# Altium schematic sheet Peripherals.SchDoc: Motor Controller - Peripherals
size A3; Author: Poteko Sakamoto; DrawnBy: Poteko Sakamoto; Revision: 2
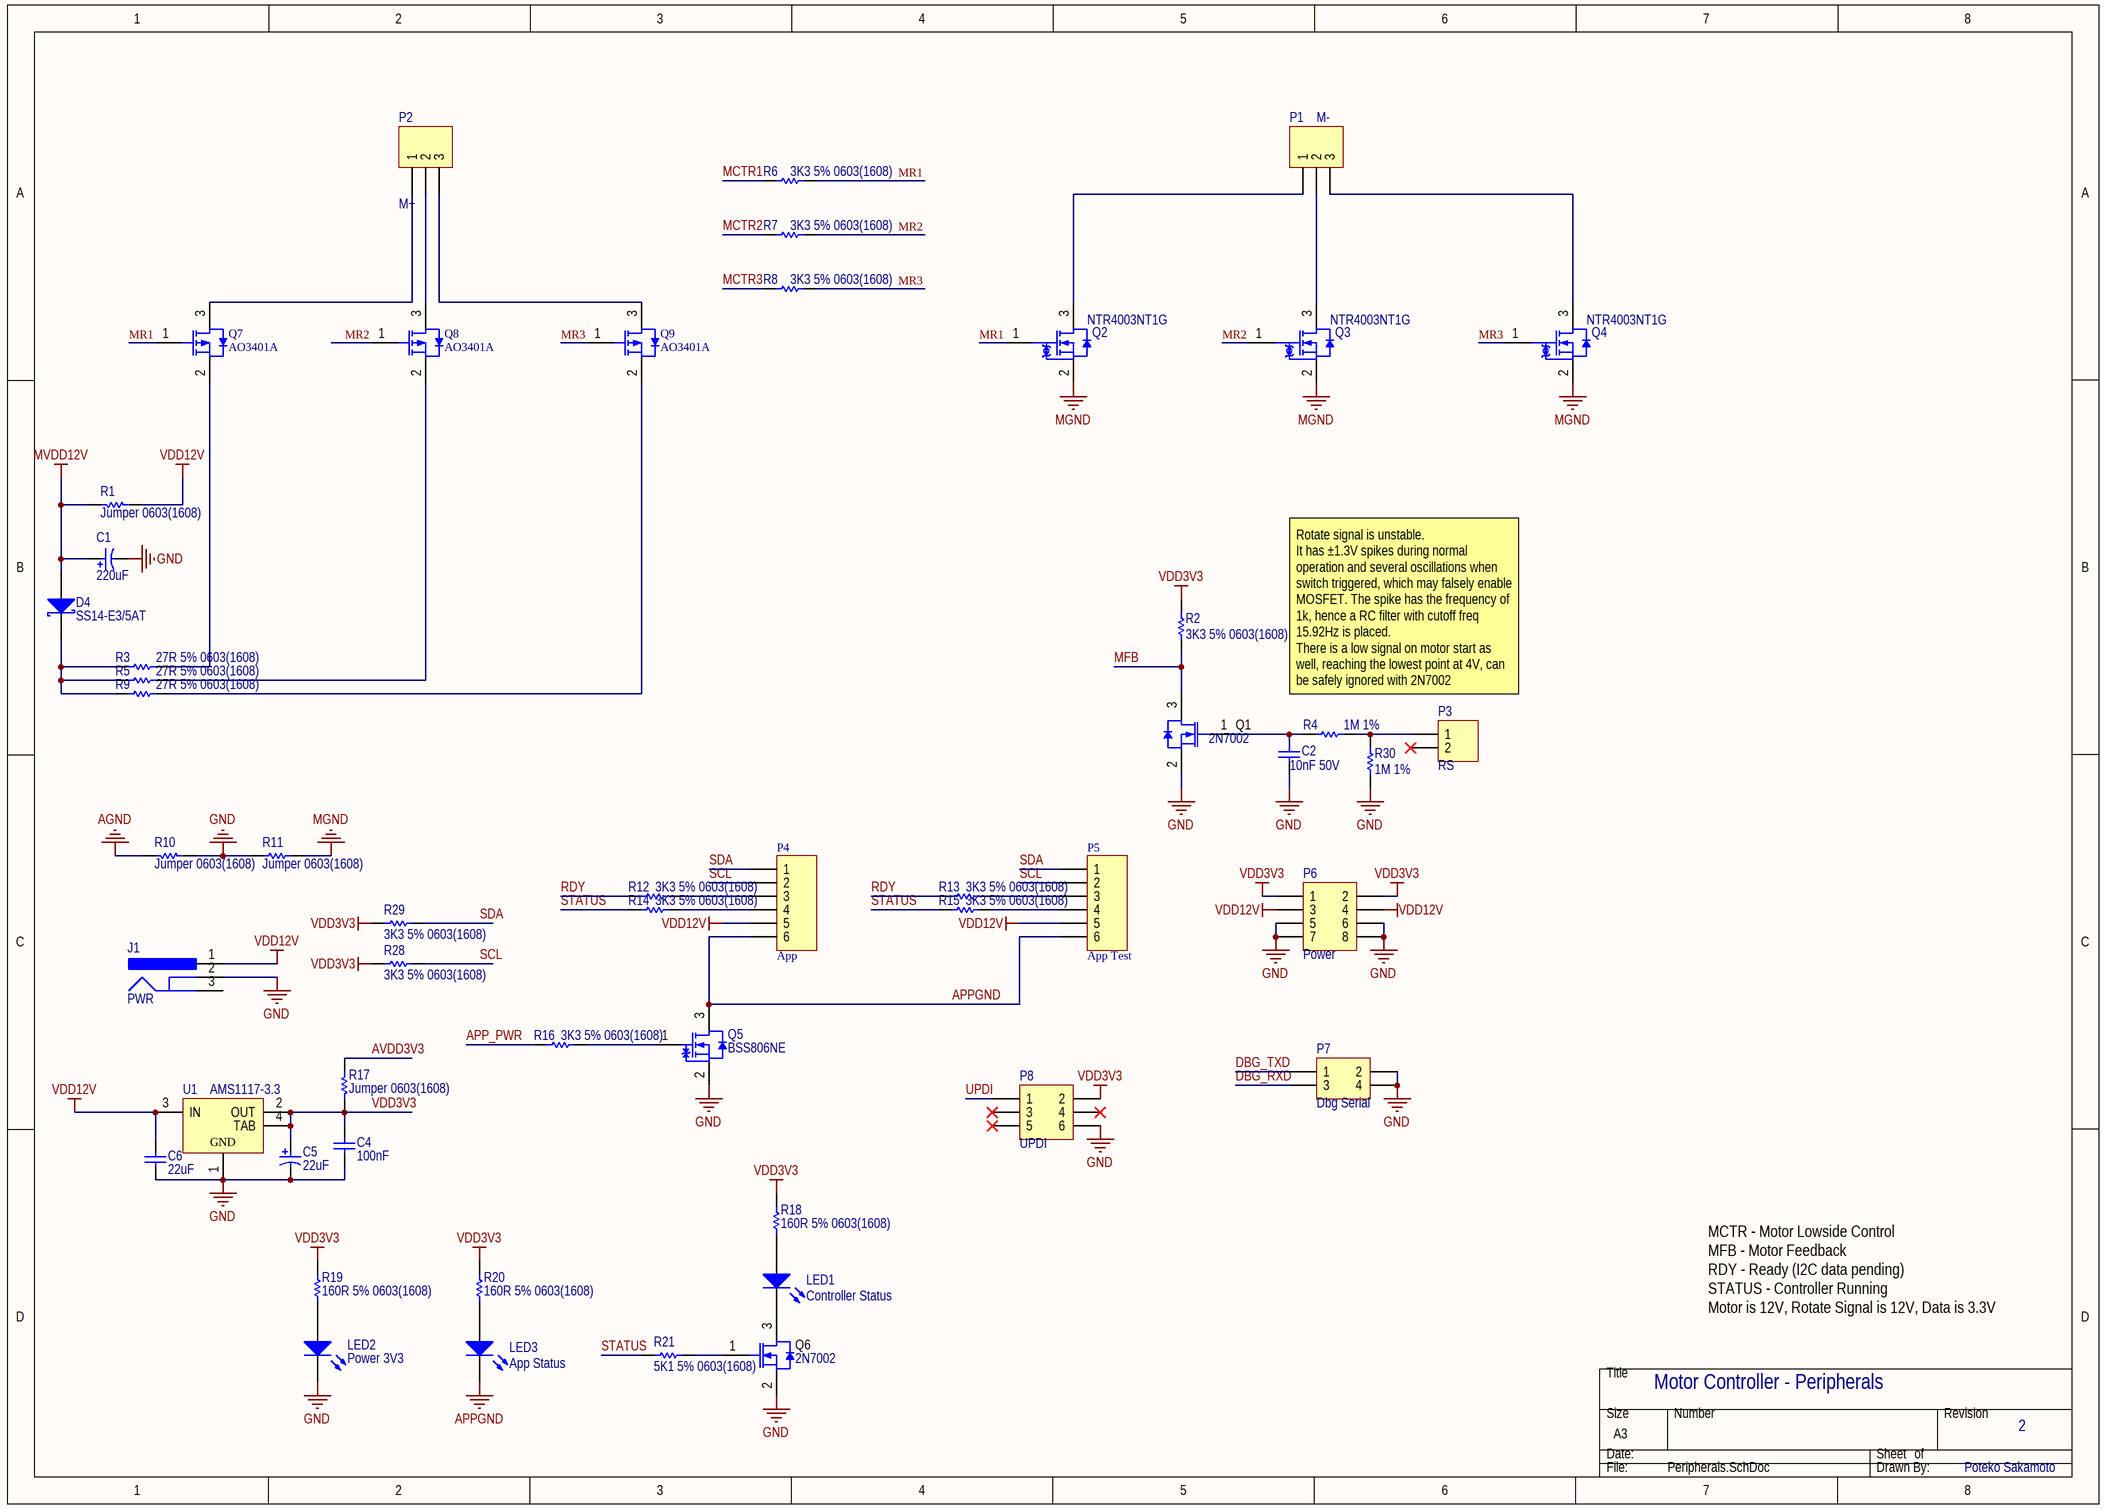
[diagram p0: Peripherals.SchDoc]

## Parts
C1  220uF  [PNSC-ZA-G_M]
C2  10nF 50V  [CAPC0603(1608)100_M]
C4  100nF  [CAPC0603(1608)100_M]
C5  22uF  [KEMT-A-3216-18-2_M]
C6  22uF  [CAPC0805(2012)145_M]
D4  SS14-E3/5AT  [VISH-DO-214AC-2_V]
J1  PWR  [KYCN-KLDX-0202-A_V]
LED1  Controller Status  [0805_A]
LED2  Power 3V3  [0805_A]
LED3  App Status  [0805_A]
P1  M-  [HDR1X3]
P2  M+  [HDR1X3]
P3  RS  [HDR1X2]
P4  App  [PH2.0-WS-6P]
P5  App Test  [HDR1X6]
P6  Power  [HDR2X4]
P7  Dbg Serial  [HDR2X2]
P8  UPDI  [HDR2X3]
Q1  2N7002  [INF-PG-SOT23_M]
Q2  NTR4003NT1G  [ONSC-SOT-23-3-318-08_V]
Q3  NTR4003NT1G  [ONSC-SOT-23-3-318-08_V]
Q4  NTR4003NT1G  [ONSC-SOT-23-3-318-08_V]
Q5  BSS806NE  [INF-PG-SOT23-3_N]
Q6  2N7002  [INF-PG-SOT23_M]
Q7  AO3401A  [AO-SOT-23-3L_V]
Q8  AO3401A  [AO-SOT-23-3L_V]
Q9  AO3401A  [AO-SOT-23-3L_V]
R1  Jumper 0603(1608)  [RESC0603(1608)_M]
R2  3K3 5% 0603(1608)  [RESC0603(1608)_M]
R3  27R 5% 0603(1608)  [RESC0603(1608)_M]
R4  1M 1%  [RESC0603(1608)_M]
R5  27R 5% 0603(1608)  [RESC0603(1608)_M]
R6  3K3 5% 0603(1608)  [RESC0603(1608)_M]
R7  3K3 5% 0603(1608)  [RESC0603(1608)_M]
R8  3K3 5% 0603(1608)  [RESC0603(1608)_M]
R9  27R 5% 0603(1608)  [RESC0603(1608)_M]
R10  Jumper 0603(1608)  [RESC0603(1608)_M]
R11  Jumper 0603(1608)  [RESC0603(1608)_M]
R12  3K3 5% 0603(1608)  [RESC0603(1608)_M]
R13  3K3 5% 0603(1608)  [RESC0603(1608)_M]
R14  3K3 5% 0603(1608)  [RESC0603(1608)_M]
R15  3K3 5% 0603(1608)  [RESC0603(1608)_M]
R16  3K3 5% 0603(1608)  [RESC0603(1608)_M]
R17  Jumper 0603(1608)  [RESC0603(1608)_M]
R18  160R 5% 0603(1608)  [RESC0603(1608)_M]
R19  160R 5% 0603(1608)  [RESC0603(1608)_M]
R20  160R 5% 0603(1608)  [RESC0603(1608)_M]
R21  5K1 5% 0603(1608)  [RESC0603(1608)_M]
R28  3K3 5% 0603(1608)  [RESC0603(1608)_M]
R29  3K3 5% 0603(1608)  [RESC0603(1608)_M]
R30  1M 1%  [RESC0603(1608)_M]
U1  AMS1117-3.3  [DCY0004A_M]

## Nets
AGND: R10.2
APPGND: LED3.1(K) P4.6 P5.6 Q5.3(DRAIN)
GND: C1.2 C2.1 C4.1 C5.2 C6.1 J1.2 LED2.1(K) P6.5 P6.6 P6.7 P6.8 P7.2 P7.4 P8.6 Q1.2(SOURCE) Q5.2(SOURCE) Q6.2(SOURCE) R10.1 R11.1 R30.1 U1.1(GND)
MGND: Q2.2(S) Q3.2(S) Q4.2(S) R11.2
MVDD12V: C1.1 D4.1(A) R1.2
VDD3V3: C4.2 C5.1 P6.1 P6.2 P8.2 R2.1 R17.2 R18.2 R19.2 R20.2 R28.1 R29.1 U1.2(OUT) U1.4(TAB)
VDD12V: C6.2 J1.1 P4.5 P5.5 P6.3 P6.4 R1.1 U1.3(IN)
APP_PWR: R16.2
AVDD3V3: R17.1
DBG_RXD: P7.3
DBG_TXD: P7.1
MCTR1: R6.2
MCTR2: R7.2
MCTR3: R8.2
MFB: Q1.3(DRAIN) R2.2
MR1: Q2.1(G) Q7.1(GATE) R6.1
MR2: Q3.1(G) Q8.1(GATE) R7.1
MR3: Q4.1(G) Q9.1(GATE) R8.1
RDY: R12.2 R13.2
SCL: P4.2 P5.2 R28.2
SDA: P4.1 P5.1 R29.2
STATUS: R14.2 R15.2 R21.1
UPDI: P8.1
NetC2_2: C2.2 Q1.1(GATE) R4.1
NetD4_2: D4.2(K) R3.1 R5.1 R9.1
NetLED1_1: LED1.1(K) Q6.3(DRAIN)
NetLED1_2: LED1.2(A) R18.1
NetLED2_2: LED2.2(A) R19.1
NetLED3_2: LED3.2(A) R20.1
NetP1_1: P1.1 Q2.3(D)
NetP1_2: P1.2 Q3.3(D)
NetP1_3: P1.3 Q4.3(D)
NetP2_1: P2.1 Q7.3(DRAIN)
NetP2_2: P2.2 Q8.3(DRAIN)
NetP2_3: P2.3 Q9.3(DRAIN)
NetP3_1: P3.1 R4.2 R30.2
NetP4_3: P4.3 R12.1
NetP4_4: P4.4 R14.1
NetP5_3: P5.3 R13.1
NetP5_4: P5.4 R15.1
NetQ5_1: Q5.1(GATE) R16.1
NetQ6_1: Q6.1(GATE) R21.2
NetQ7_2: Q7.2(SOURCE) R3.2
NetQ8_2: Q8.2(SOURCE) R5.2
NetQ9_2: Q9.2(SOURCE) R9.2

Not connected (* = marked no-connect by the designer): J1 3; P3 2*; P8 3* 4* 5*

## Notes on the sheet
- Rotate signal is unstable.
  It has ±1.3V spikes during normal operation and several oscillations when switch triggered, which may falsely enable MOSFET. The spike has the frequency of 1k, hence a RC filter with cutoff freq 15.92Hz is placed.
  There is a low signal on motor start as well, reaching the lowest point at 4V, can be safely ignored with 2N7002
- MCTR - Motor Lowside Control
  MFB - Motor Feedback
  RDY - Ready (I2C data pending)
  STATUS - Controller Running
  Motor is 12V, Rotate Signal is 12V, Data is 3.3V
- Title
- Size:
- Date:
- A4
- Number:
- Time:
- Revision:
- Sheet
- of
- File:

## Library data of the parts
C1 = CMP-2000-06221-1: Conductive Polymer Hybrid Aluminum Electrolytic Capacitor, 220 uF, +/- 20%, 50 V, -55 to 105 degC, 2-Pin SMD (G), RoHS, Tape and Reel; Case Height: 10.5mm; Voltage Rating DC: 50V; Case Diameter: 10mm; Ripple Current: 2A; Load Life: 10000Hour; Brand: Panasonic; Case Length: 10.2mm; ESR: 28mOhms; Capacitance: 100uF; Manufacturer URL: http://www.panasonic.com/; Minimum Operating Temperature: -55C; Datasheet Version: 06/2016; Product Category: AluminumOrganicPolymerCapacitors; Maximum Operating Temperature: +105C; Package Description: 2-Pin Surface Mount Device, Body 10.3 x 10.3 mm; Package Reference: ZA-G; RoHS: Details; Series: ZA; Tolerance: 20%; Product: AluminumElectrolyticCapacitors; Factory Pack Quantity: 500; Manufacturer: Panasonic; Termination Style: SMD/SMT; Datasheet URL: https://industrial.panasonic.com/cdbs/www-data/pdf/RDD0000/DMD0000COL56.pdf; Mounting Technology: SurfaceMount; Packaging: Reel; Height: 10.5mm
C2 = CMP-1035-02320-1: CAP 10nF 50V ±5% 0603 (1608 Metric) Thickness 1mm SMD; Case-EIA: 0603; Tolerance: Â±5%; Case-Metric: 1608; Value: 10nF; Max Thickness: 1 mm; Technology: SMT; Rated Voltage: 50 V
C4 = CMP-1035-02592-1: CAP 100nF 50V ±10% 0603 (1608 Metric) Thickness 1mm SMD; Case-EIA: 0603; Case-Metric: 1608; Tolerance: Â±10%; Technology: SMT; Rated Voltage: 50 V; Max Thickness: 1 mm; Value: 100nF
C5 = CMP-2000-05173-1: Capacitor, Tantalum, 22 uF, +/- 10%, 16 V, -55 to 125 degC, 2-Pin SMD (1206), RoHS, Tape and Reel; Manufacturer: Kemet; Insulation: NotRequired; Voltage: 16VDC; Capacitance: 10uF; Product Height (mm): 1.6mm; Polarity: Polar; Lead Spacing (nom): NotRequiredmm; Product Length (mm): 3.2mm; Case Style: Molded; DCL: 1.6uA; ESR: 7ohm; DF: 8%; Mounting Style: SurfaceMount; Manufacturer URL: http://www.kemet.com/; Datasheet Version: Apr-14; Package Description: 2-Pin Surface Mount Device, Body 3.2 x 1.6 mm; Operating Temp Range: -55Cto125C; Package Reference: 1206; Wire Form: NotRequired; Datasheet URL: http://www.farnell.com/datasheets/1824869.pdf; Tolerance (+ or -): 10%; Failure Rate: NotRequired; Length W/Weld: NotRequiredmm; Package / Case: 3216-18; Seated Plane Height: NotRequiredmm; Product Diameter (mm): NotRequiredmm; Construction: SMTChip; Seal: NotRequired; Case Code: A; Product Depth (mm): 1.6mm; Packaging: TapeandReel
C6 = CMP-1036-04942-1: CAP 22uF 10V ±10% 0805 (2012 Metric) Thickness 1.45mm SMD; Case-EIA: 0805; Case-Metric: 2012; Tolerance: Â±10%; Rated Voltage: 10 V; Max Thickness: 1.45 mm; Value: 22uF; Technology: SMT
D4 = CMP-0549-00004-1: Schottky Barrier Rectifier, 40 V Maximum DC Blocking Voltage, -65 to 125 degC, 2-Pin SMA Case, RoHS; Manufacturer: Vishay Semiconductor; IFSM: 40 A; IF(AV): 1 A Max.; VRRM: 40 V Max.; VRMS: 28 V Max.; PackageReference: DO-214AC-2; RoHS: TRUE; DatasheetVersion: 12/17/2012; ComponentLink1Description: Manufacturer URL; ComponentLink2URL: http://www.vishay.com/docs/88746/ss12.pdf; PartNumber: SS14-E3/5AT; PackageVersion: Dec-12; Operating Temperature: -65 to 125 degC; ComponentLink3URL: http://www.vishay.com/docs/88746/ss12.pdf; PackageDescription: 2-Pin SMD, Body 4.245 x 2.665 mm, Height 2.29 mm; ComponentLink1URL: http://www.vishay.com/; ComponentLink3Description: Package Specification; ComponentLink2Description: Datasheet; Mounting Technology: Surface Mount; VDC: 40 V Max.
J1 = CMP-1673-00001-5: DC Power Jack, 24 V, 3.5 A, -25 to 85 degC, 3-Pin THD, RoHS; Manufacturer: Kycon; Voltage Rating: 24 V; Current Rating: 3.5 A; PackageReference: KLDX-0202-A; ComponentLink1URL: http://www.kycon.com/; ComponentLink1Description: Manufacturer URL; Height: 10.8 mm; Length: 9.2 mm; Pins: 2; Housing Material: PBT; Connector Type: Power; ComponentLink2URL: http://www.kycon.com/Pub_Eng_Draw/KLDX-0202-X.PDF; PackageDescription: 3-Pin Through Hole Device, Body 14.5 x 9 mm; Max Operating Temperature: 85 degC; Min Operating Temperature: -25 degC; Contact Gender: Female; Package Quantity: 500; Mount: Through Hole; Colour: Black; Contact Plating: Tin; DatasheetVersion: Rev. D3, 06/2013; ComponentLink2Description: Datasheet; RoHSCompliant: true; Mounting Technology: Through Hole; Contact Material: Brass
LED1 LED3 = CMP-1426-00008-1: SMD mono-color Chip LED, WL-SMCW, Blue; Manufacturer: Wuerth Elektronik; PartNumber: 150080BS75000; Color: Blue; ComponentLink2URL: http://katalog.we-online.com/led/datasheet/150080BS75000.pdf; ComponentLink1URL: http://www.we-online.com; ComponentLink2Description: Datasheet; PackageReference: 0805_A; ComponentLink1Description: Manufacturer URL
LED2 = CMP-1426-00007-1: SMD mono-color Chip LED, WL-SMCW, Green; PartNumber: 150080GS75000; Manufacturer: Wuerth Elektronik; PackageReference: 0805_A; Color: Green; ComponentLink2URL: http://katalog.we-online.com/led/datasheet/150080GS75000.pdf; ComponentLink1URL: http://www.we-online.com; ComponentLink1Description: Manufacturer URL; ComponentLink2Description: Datasheet
P1 P2 = Header 3: Header, 3-Pin; LatestRevisionDate: 17-Jul-2002; LatestRevisionNote: Re-released for DXP Platform.; Publisher: Altium Limited
P3 = Header 2: Header, 2-Pin; LatestRevisionDate: 17-Jul-2002; LatestRevisionNote: Re-released for DXP Platform.; Publisher: Altium Limited
P4 P5 = Header 6: Header, 6-Pin; LatestRevisionDate: 17-Jul-2002; LatestRevisionNote: Re-released for DXP Platform.; Publisher: Altium Limited
P6 = Header 4X2: Header, 4-Pin, Dual row; LatestRevisionDate: 17-Jul-2002; LatestRevisionNote: Re-released for DXP Platform.; Publisher: Altium Limited
P7 = Header 2X2: Header, 2-Pin, Dual row; LatestRevisionDate: 17-Jul-2002; LatestRevisionNote: Re-released for DXP Platform.; Publisher: Altium Limited
P8 = Header 3X2: Header, 3-Pin, Dual row; LatestRevisionDate: 17-Jul-2002; LatestRevisionNote: Re-released for DXP Platform.; Publisher: Altium Limited
Q1 Q6 = CMP-1149-00026-1: N-Channel OptiMOS Small-Signal-Transistor, 60 V VDS, 0.3 A ID, -55 to 150 degC, PG-SOT23, Reel, Green; Manufacturer: Infineon; RDS (on) (max) (@4.5V): 4,000 mOhm; VDS (max): 60 V; IDpuls (max): 1.2Â A; QG: 0.4Â nC; RDS (on) (max): 3,000 mOhm; RthJA (max): 250 K/W; ID (max): 0.3Â A; VGS(th) (max): 2.5Â V; VGS(th) (min): 1.5Â V; Green: TRUE; Ptot (max): 0.5Â W; PackageDescription: 3-Pin Small Outline Transistor Package, 2.9 x 1.3 mm Body, 0.95 mm Pitch; Halogen-free: TRUE; ComponentLink2Description: Datasheet; ComponentLink1URL: http://www.infineon.com/; Packing: Reel; DatasheetVersion: Rev. 2.4; PartNumber: 2N7002; PackageReference: PG-SOT23; PackageVersion: Apr-08; ComponentLink3URL: http://www.infineon.com/dgdl/SOT23-Package_Overview.pdf?folderId=db3a30431936bc4b0119532290053c66&fileId=db3a30431936bc4b0119533468123c85; ComponentLink1Description: Manufacturer URL; Mounting Technology: Surface Mount; ComponentLink3Description: Package Specification; ComponentLink2URL: http://www.infineon.com/dgdl/2N7002_Rev2.4.pdf?folderId=db3a3043156fd573011622e10b5c1f67&fileId=db3a304319bc939a0119c2a9461e79e6
Q2-Q4 = CMP-1058-00759-1: Small Signal MOSFET, 30 V, 0.56 A, Single N-Channe, 3-Pin SOT-23, Pb-Free, Tape and Reel; Manufacturer: On Semiconductor; ID Max (A): 0.56; VGS(th) Max (V): 1.4; Coss Typ (pF): 19.7; Channel Polarity: N Channel; Ciss Typ (pF): 21; Crss Typ (pF): 8.1; V(BR)DSS Min (V): 30; VGS Max (V): 20; ComponentLink2Description: Datasheet; Configuration: Single; ComponentLink3Description: Package Specification; PackageDescription: 3-Pin Small Outline Transistor, Body 2.92 x 1.3 mm, Pitch 0.95 mm; DatasheetVersion: Rev. 3; ComponentLink1URL: http://www.onsemi.com/; Mounting Technology: Surface Mount; Package Type: SOT-23-3; RoHS: Pb-Free; PackageVersion: Rev. AP, 11/2009; PartNumber: NTR4003NT1G; ComponentLink3URL: http://www.onsemi.cn/pub_link/Collateral/318-08.PDF; Packing: Tape and Reel; ComponentLink2URL: http://www.onsemi.cn/pub_link/Collateral/NTR4003N-D.PDF; ComponentLink1Description: Manufacturer URL; PackageReference: SOT-23-3-318-08
Q5 = CMP-1149-00037-1: N-Channel OptiMOS(TM)2 Small-Signal-Transistor, 20 V VDS, 2.3 A ID, -55 to 150 degC, PG-SOT23-3, Reel, Green; Manufacturer: Infineon; Green: TRUE; ID (max): 2.3Â A; IDpuls (max): 9.3Â A; Mode: Enhancement; QG: 1.7Â nC; Polarity: FALSE; VGS(th) (min): 0.3Â V; RthJA (max): 250Â K/W; Ptot (max): 0.5Â W; VDS (max): 20Â V; VGS(th) (max): 0.75Â V; ComponentLink2URL: http://www.infineon.com/dgdl/BSS806NE_Rev2+01.pdf?folderId=db3a3043156fd573011622e10b5c1f67&fileId=db3a304340f610c201410d1548de3366; PackageDescription: 3-Pin Small Outline Transistor Package, 1.25 x 2 mm Body, 0.65 mm Pitch; PackageReference: PG-SOT23-3; ComponentLink2Description: Datasheet; ComponentLink3URL: http://www.infineon.com/dgdl/SOT23-Package_Overview.pdf?folderId=db3a30431936bc4b0119532290053c66&fileId=db3a30431936bc4b0119533468123c85; PackageVersion: Apr-08; ComponentLink1Description: Manufacturer URL; Halogen-free: TRUE; Mounting Technology: Surface Mount; ComponentLink3Description: Package Specification; DatasheetVersion: Rev. 2.01; PartNumber: BSS806NE; Mounting: SMD; ComponentLink1URL: http://www.infineon.com/; Packing: Reel
Q7-Q9 = CMP-2000-05778-1: P-Channel MOSFET, 30 V, 4 A, -55 to 150 degC, 3-Pin SOT-23-3L, RoHS, Tape and Reel; Manufacturer: Alpha and Omega; Output Power (Max): NotRequiredW; Power Dissipation: 1.4W; Rad Hardened: No; Drain Efficiency: NotRequired%; Drain-Source On-Volt: 30V; Noise Figure: NotRequireddB; Frequency (Max): NotRequiredMHz; Number of  Elements: 1; Gate-Source Voltage (Max): ?12V; Drain Current (Max): 4A; Channel Mode: Enhancement; Drain-Source On-Res: 0.044ohm; Type: PowerMOSFET; Polarity: P; Package URL: http://www.aosmd.com/res/packaging_information/SOT-23-3L.pdf; Datasheet URL: http://www.aosmd.com/res/data_sheets/AO3401A.pdf; Package Type: SOT-23; Package Description: 3-Pin Small Outline Transistor, Body 2.95 x 1.6 mm, Pitch 0.95 mm; Mounting: SurfaceMount; Manufacturer URL: http://www.aosmd.com/; Continuous Drain Current: 4A; Package Reference: SOT-23-3L; Mounting Technology: SurfaceMount; Operating Temperature Classification: Military; Power Gain: NotRequireddB; Datasheet Version: Rev. 3, 03/2011; Operating Temp Range: -55Cto150C; Pin Count: 3
R1 R10 R11 R17 = CMP-1012-00001-1: Jumper 0603 (1608 Metric); Case-Metric: 1608; Value: 0.00 Ohm; Power: None; Case-EIA: 0603; Technology: SMT; Tolerance: None
R2 R6-R8 R12-R16 R28 R29 = CMP-1012-00086-1: 3K3 0.1W 5% 0603 (1608 Metric)  SMD; Case-EIA: 0603; Value: 3300.00 Ohm; Case-Metric: 1608; Technology: SMT; Tolerance: 5 %; Power: 0.1 W
R3 R5 R9 = CMP-1012-00036-1: 27R 0.1W 5% 0603 (1608 Metric)  SMD; Value: 27.00 Ohm; Case-EIA: 0603; Case-Metric: 1608; Power: 0.1 W; Technology: SMT; Tolerance: 5 %
R4 R30 = CMP-1012-00849-1: 1M 0.1W 1% 0603 (1608 Metric)  SMD; Value: 1000000.00 Ohm; Case-EIA: 0603; Case-Metric: 1608; Power: 0.1 W; Tolerance: 1 %; Technology: SMT
R18-R20 = CMP-1012-00055-1: 160R 0.1W 5% 0603 (1608 Metric)  SMD; Case-Metric: 1608; Value: 160.00 Ohm; Case-EIA: 0603; Tolerance: 5 %; Technology: SMT; Power: 0.1 W
R21 = CMP-1012-00091-1: 5K1 0.1W 5% 0603 (1608 Metric)  SMD; Case-Metric: 1608; Value: 5100.00 Ohm; Case-EIA: 0603; Technology: SMT; Tolerance: 5 %; Power: 0.1 W
U1 = CMP-0062-01659-4: 800mA Low-Dropout Linear Regulator, 4-pin SOT-223; PartNumber: LM1117MPX-3.3; Manufacturer: Texas Instruments; PackageTopMarking: XYTT*N05A; High-Reliability: Y; PowerWise: N; CompType: LDO IC; PackageDescription: Molded SOT-223, 6.50 x 3.56 x 1.6mm Body, 4 Lead, 2.3mm Pitch; PackageReference: DCY0004A; ComponentLink1Description: Datasheet URL; RoHS: N; PinCount: 4; Code_IPC: SOT223-4; Code_JEDEC: TO-261-AA; ComponentLink1URL: http://www.ti.com/general/docs/lit/getliterature.tsp?genericPartNumber=LM1117-N&fileType=pdf